# EAGLE design pro_event_light_b_mkI_base_board (EAGLE 7.7.0)

## Sheet 1 of 3: Spannungsversorgung
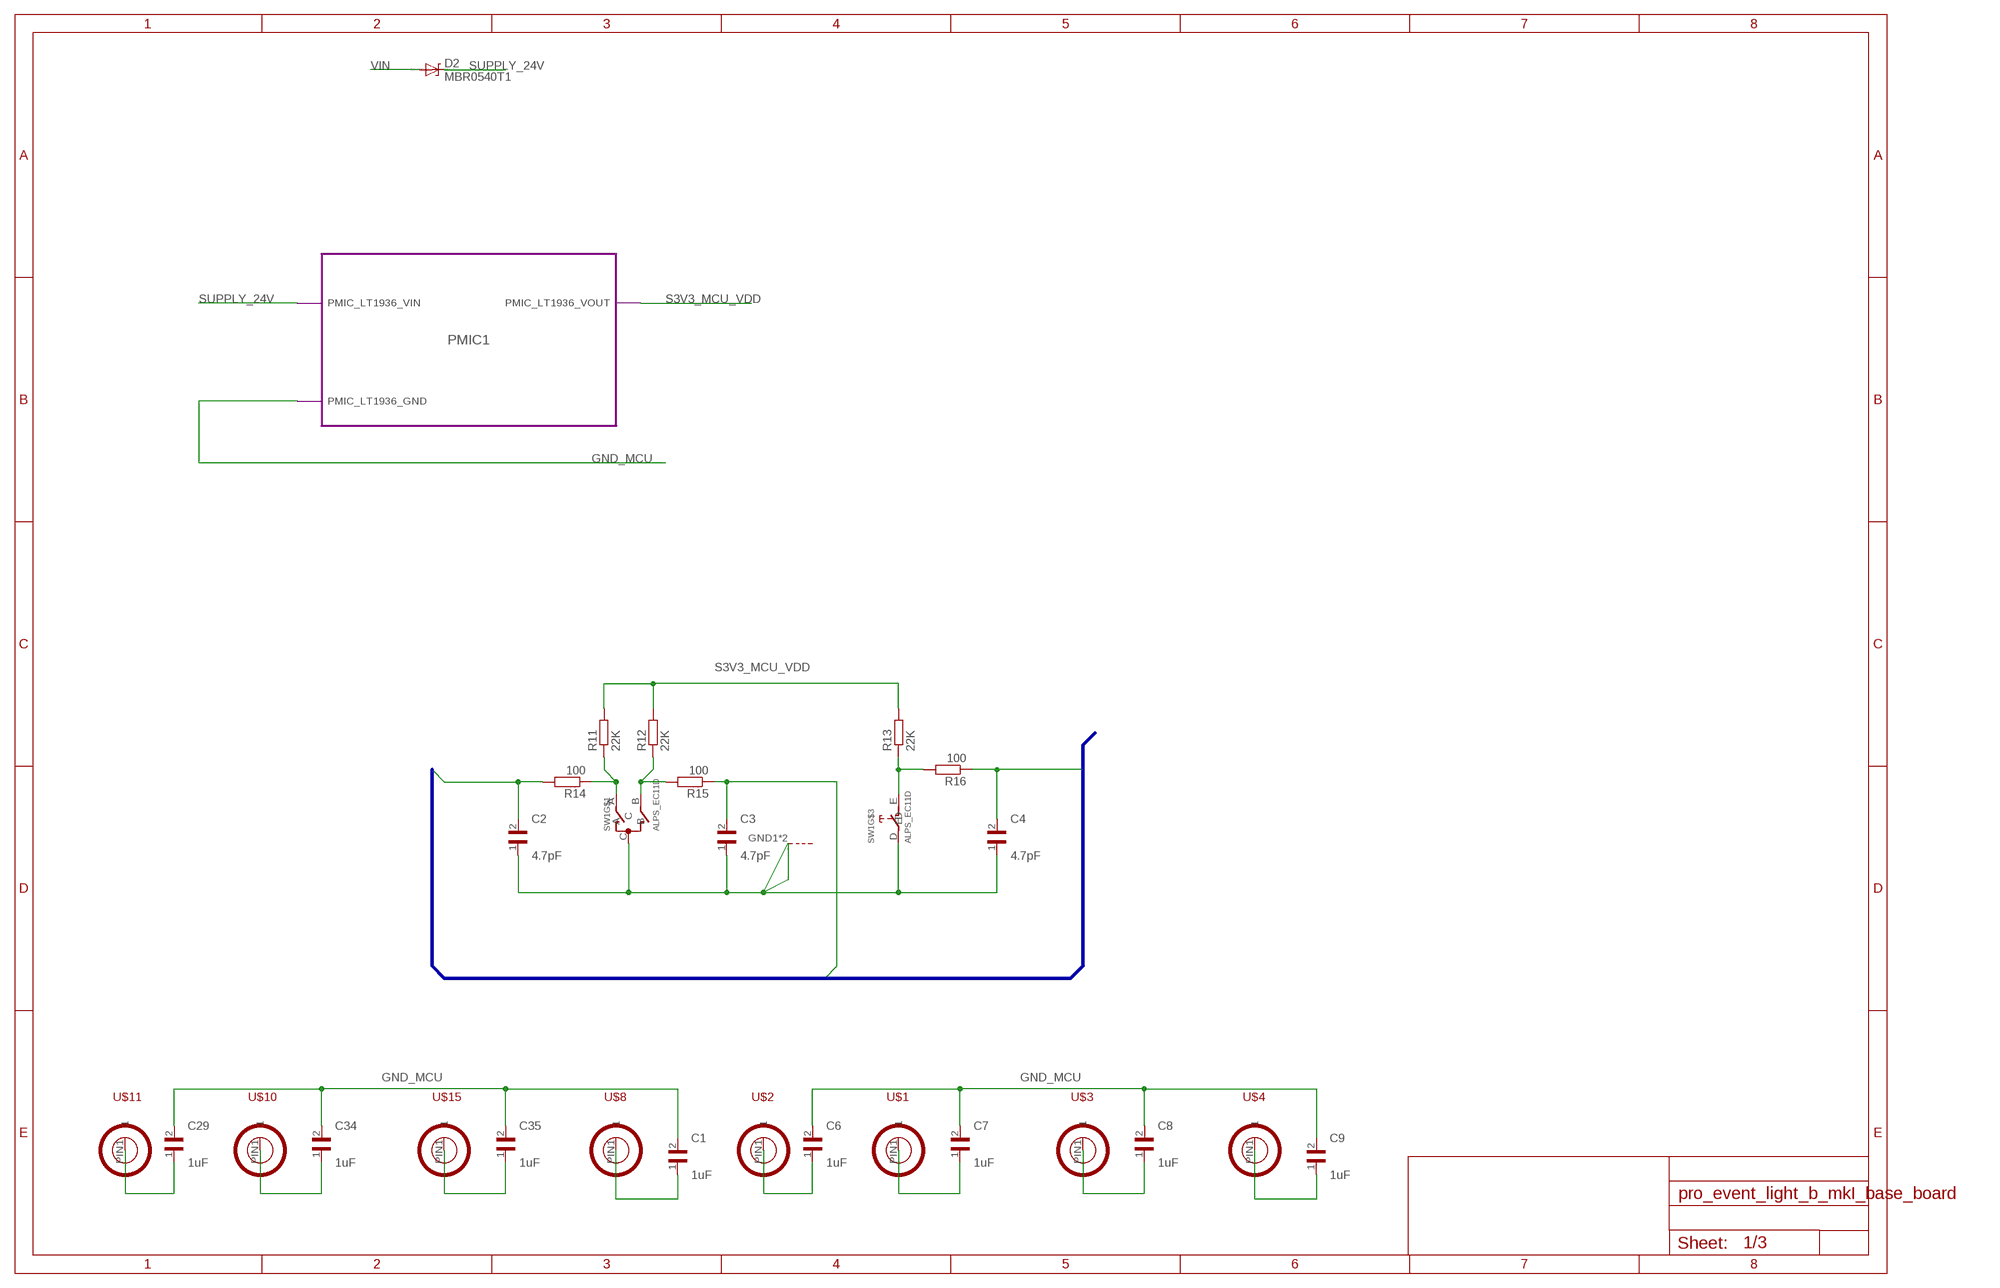
[diagram p0: schematic, sheet 1]

### Parts
C1  1uF  WCAP-CSGP_1206  [WCAP-CSGP_1206]
C2  4.7pF  WCAP-CSGP_0603-WAVE  [WCAP-CSGP_0603_WAVE]
C3  4.7pF  WCAP-CSGP_0603-WAVE  [WCAP-CSGP_0603_WAVE]
C4  4.7pF  WCAP-CSGP_0603-WAVE  [WCAP-CSGP_0603_WAVE]
C6  1uF  WCAP-CSGP_1206  [WCAP-CSGP_1206]
C7  1uF  WCAP-CSGP_1206  [WCAP-CSGP_1206]
C8  1uF  WCAP-CSGP_1206  [WCAP-CSGP_1206]
C9  1uF  WCAP-CSGP_1206  [WCAP-CSGP_1206]
C29  1uF  WCAP-CSGP_1206  [WCAP-CSGP_1206]
C34  1uF  WCAP-CSGP_1206  [WCAP-CSGP_1206]
C35  1uF  WCAP-CSGP_1206  [WCAP-CSGP_1206]
D2  MBR0540T1  [SOD123]
R11  22K  R-EU_R0603  [R0603]
R12  22K  R-EU_R0603  [R0603]
R13  22K  R-EU_R0603  [R0603]
R14  100  R-EU_R0603  [R0603]
R15  100  R-EU_R0603  [R0603]
R16  100  R-EU_R0603  [R0603]
SW1  ALPS_EC11D  [ALPS_EC11D]
U$1  PCB_MOUNTING_HOLES_M3  [PCB_MOUNTING_HOLES_M3]
U$2  PCB_MOUNTING_HOLES_M3  [PCB_MOUNTING_HOLES_M3]
U$3  PCB_MOUNTING_HOLES_M3  [PCB_MOUNTING_HOLES_M3]
U$4  PCB_MOUNTING_HOLES_M3  [PCB_MOUNTING_HOLES_M3]
U$8  PCB_MOUNTING_HOLES_M3  [PCB_MOUNTING_HOLES_M3]
U$10  PCB_MOUNTING_HOLES_M3  [PCB_MOUNTING_HOLES_M3]
U$11  PCB_MOUNTING_HOLES_M3  [PCB_MOUNTING_HOLES_M3]
U$15  PCB_MOUNTING_HOLES_M3  [PCB_MOUNTING_HOLES_M3]

### Module instances
PMIC1 = PMIC_LT1936

### Nets
ENCODER_A: C2.2 R14.2 ; also sheet 2
ENCODER_B: C3.2 R15.1 ; also sheet 2
ENCODER_D: C4.2 R16.1 ; also sheet 2
GND_MCU [MCU_Ground]: C1.2 C2.1 C3.1 C4.1 C6.2 C7.2 C8.2 C9.2 C29.2 C34.2 C35.2 SW1.C SW1.D SW1.GND1(G) SW1.GND2(G) ; port PMIC1.PMIC_LT1936_GND ; also sheet 2,3
N$1: R11.1 R14.1 SW1.A
N$2: R12.1 R15.2 SW1.B
N$5: C6.1 U$2.PIN1
N$8: C7.1 U$1.PIN1
N$9: C29.1 U$11.PIN1
N$10: C8.1 U$3.PIN1
N$11: C9.1 U$4.PIN1
N$15: C34.1 U$10.PIN1
N$16: R13.1 R16.2 SW1.E
N$17: C35.1 U$15.PIN1
N$18: C1.1 U$8.PIN1
S3V3_MCU_VDD: R11.2 R12.2 R13.2 ; port PMIC1.PMIC_LT1936_VOUT ; also sheet 2
SUPPLY_24V [MCU_Power]: D2.C ; port PMIC1.PMIC_LT1936_VIN ; also sheet 3
VIN: D2.A

### Buses
ENCODER_BUS:ENCODER_A,ENCODER_B,ENCODER_D

## Sheet 2 of 3: Mikrocontroller
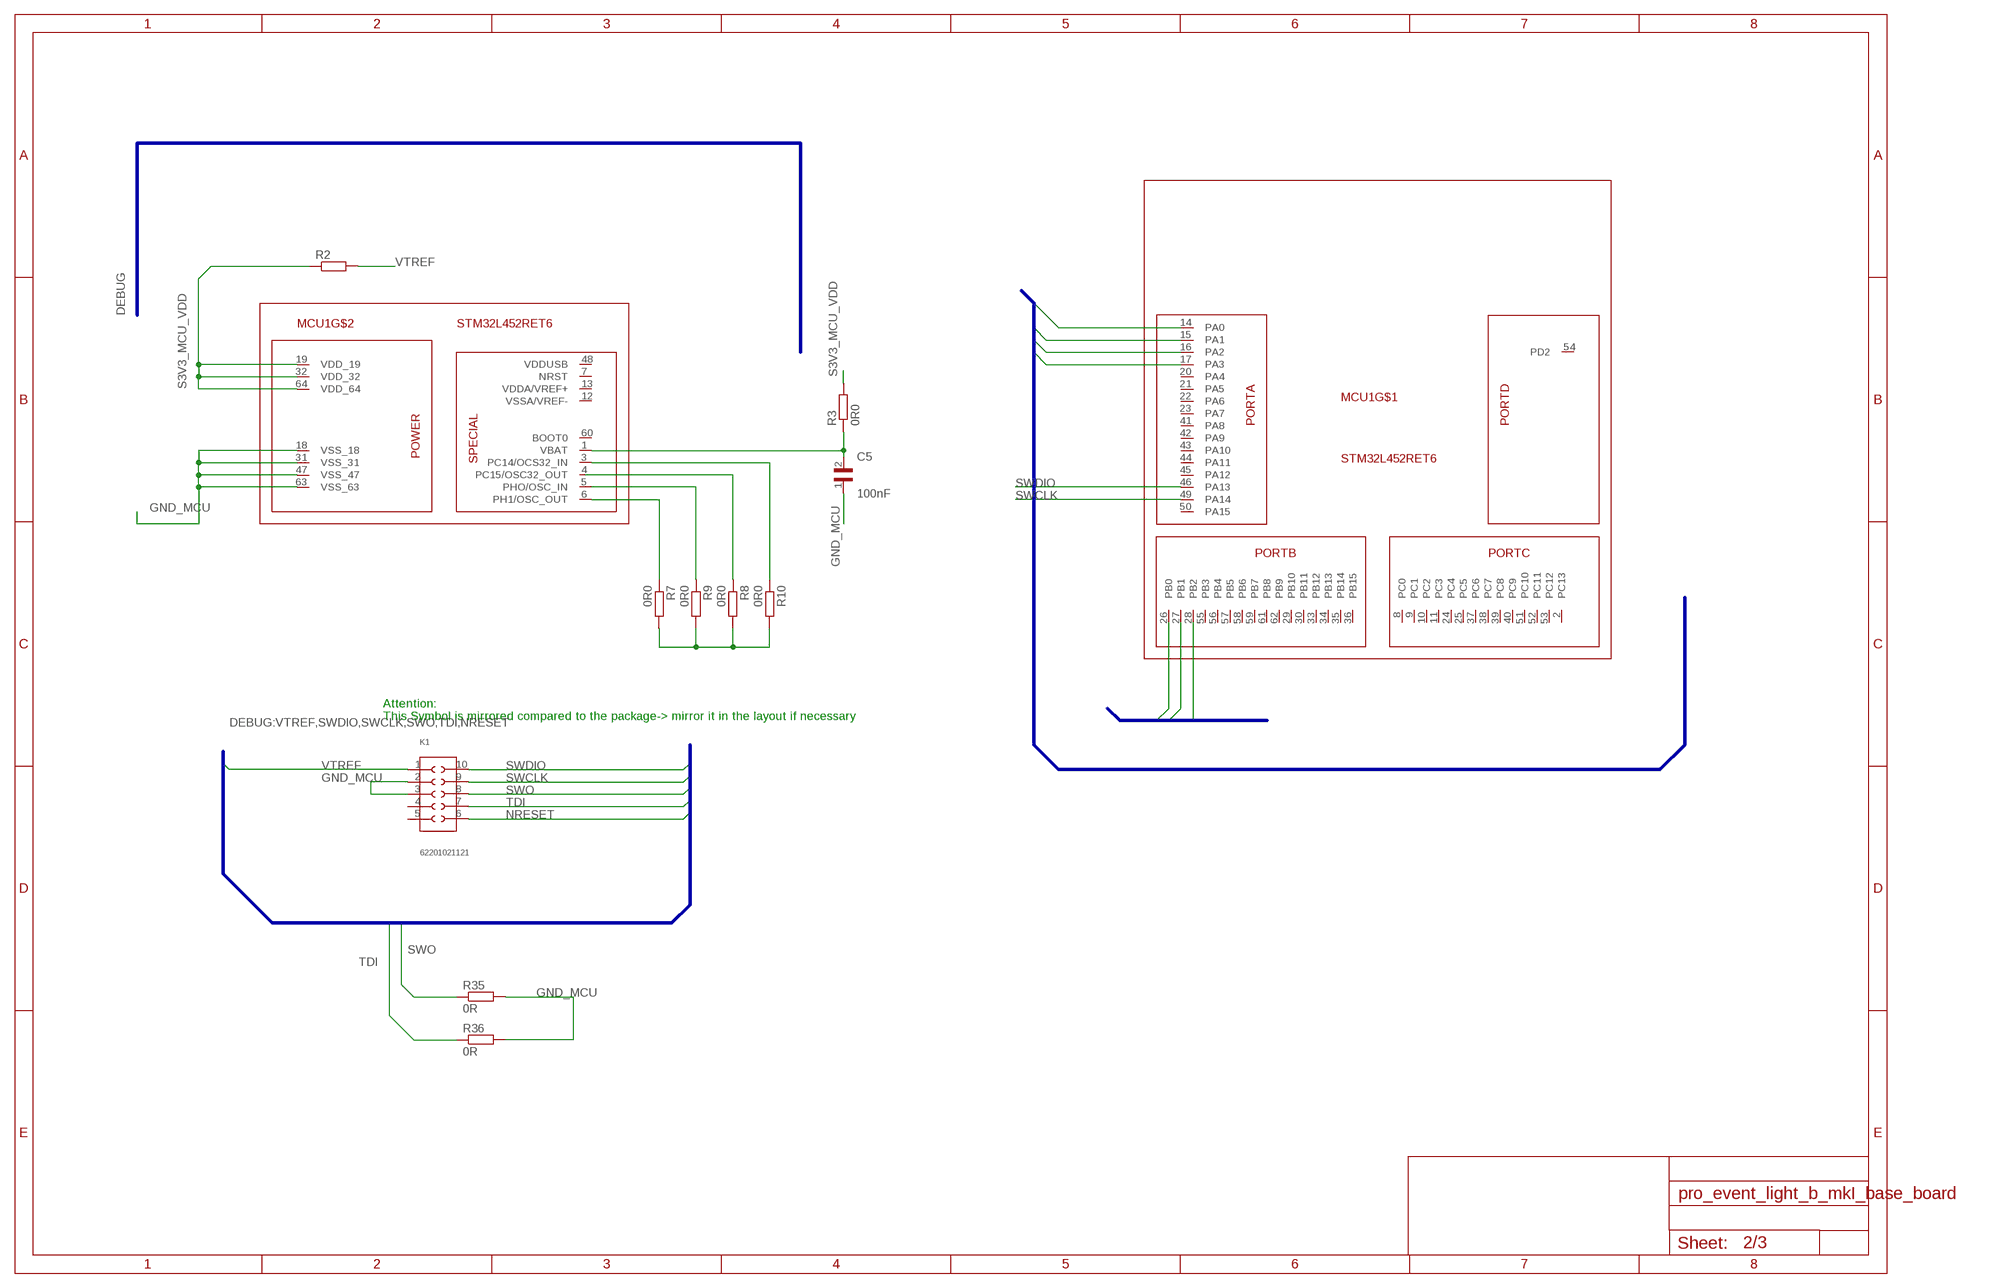
[diagram p1: schematic, sheet 2]

### Parts
C5  100nF  WCAP-CSGP_0603-REFLOW  [WCAP-CSGP_0603_REFLOW]
K1  62201021121  [62201021121]
MCU1  STM32L452RET6  [LQFP64]
R2  R-EU_R0603  [R0603]
R3  0R0  R-EU_R0603  [R0603]
R7  0R0  R-EU_R0603  [R0603]
R8  0R0  R-EU_R0603  [R0603]
R9  0R0  R-EU_R0603  [R0603]
R10  0R0  R-EU_R0603  [R0603]
R35  0R  R-EU_R0603  [R0603]
R36  0R  R-EU_R0603  [R0603]

### Nets
ENCODER_A: MCU1.26(PB0) ; also sheet 1
ENCODER_B: MCU1.27(PB1) ; also sheet 1
ENCODER_D: MCU1.28(PB2) ; also sheet 1
GND_MCU [MCU_Ground]: C5.1 K1.2 K1.3 MCU1.18(VSS_18) MCU1.47(VSS_47) MCU1.63(VSS_63) R7.2 R8.2 R9.2 R10.2 R35.2 R36.2 ; also sheet 1,3
LEDB: MCU1.15(PA1) ; also sheet 3
LEDG: MCU1.14(PA0) ; also sheet 3
LEDR: MCU1.16(PA2) ; also sheet 3
LEDW: MCU1.17(PA3) ; also sheet 3
N$19: C5.2 MCU1.1(VBAT) R3.1
N$20: MCU1.3(PC14/OCS32_IN) R10.1
N$21: R8.1
N$26: MCU1.5(PHO/OSC_IN) R9.1
N$27: MCU1.6(PH1/OSC_OUT) R7.1
NRESET [Debug]: K1.6
S3V3_MCU_VDD: MCU1.19(VDD_19) MCU1.32(VDD_32) MCU1.64(VDD_64) R2.1 R3.2 ; also sheet 1
SWCLK [Debug]: K1.9 MCU1.49(PA14)
SWDIO [Debug]: K1.10 MCU1.46(PA13)
SWO [Debug]: K1.8 R35.1
TDI [Debug]: K1.7 R36.1
VTREF [Debug]: K1.1 R2.2
Unconnected: K1.4 K1.5 MCU1.2(PC13) MCU1.4(PC15/OSC32_OUT) MCU1.7(NRST) MCU1.8(PC0) MCU1.9(PC1) MCU1.10(PC2) MCU1.11(PC3) MCU1.12(VSSA/VREF-) MCU1.13(VDDA/VREF+) MCU1.20(PA4) MCU1.21(PA5) MCU1.22(PA6) MCU1.23(PA7) MCU1.24(PC4) MCU1.25(PC5) MCU1.29(PB10) MCU1.30(PB11) MCU1.31(VSS_31) MCU1.33(PB12) MCU1.34(PB13) MCU1.35(PB14) MCU1.36(PB15) MCU1.37(PC6) MCU1.38(PC7) MCU1.39(PC8) MCU1.40(PC9) MCU1.41(PA8) MCU1.42(PA9) MCU1.43(PA10) MCU1.44(PA11) MCU1.45(PA12) MCU1.48(VDDUSB) MCU1.50(PA15) MCU1.51(PC10) MCU1.52(PC11) MCU1.53(PC12) MCU1.54(PD2) MCU1.55(PB3) MCU1.56(PB4) MCU1.57(PB5) MCU1.58(PB6) MCU1.59(PB7) MCU1.60(BOOT0) MCU1.61(PB8) MCU1.62(PB9)

### Buses
DEBUG:VTREF,SWDIO,SWCLK,SWO,TDI,NRESET
DEBUG
LEDBUS:LEDG,LEDB,LEDR,LEDW
ENCODER_BUS:ENCODER_A,ENCODER_B,ENCODER_D

### Notes on the sheet
- Attention:
  This Symbol is mirrored compared to the package-> mirror it in the layout if necessary

## Sheet 3 of 3: LED Power
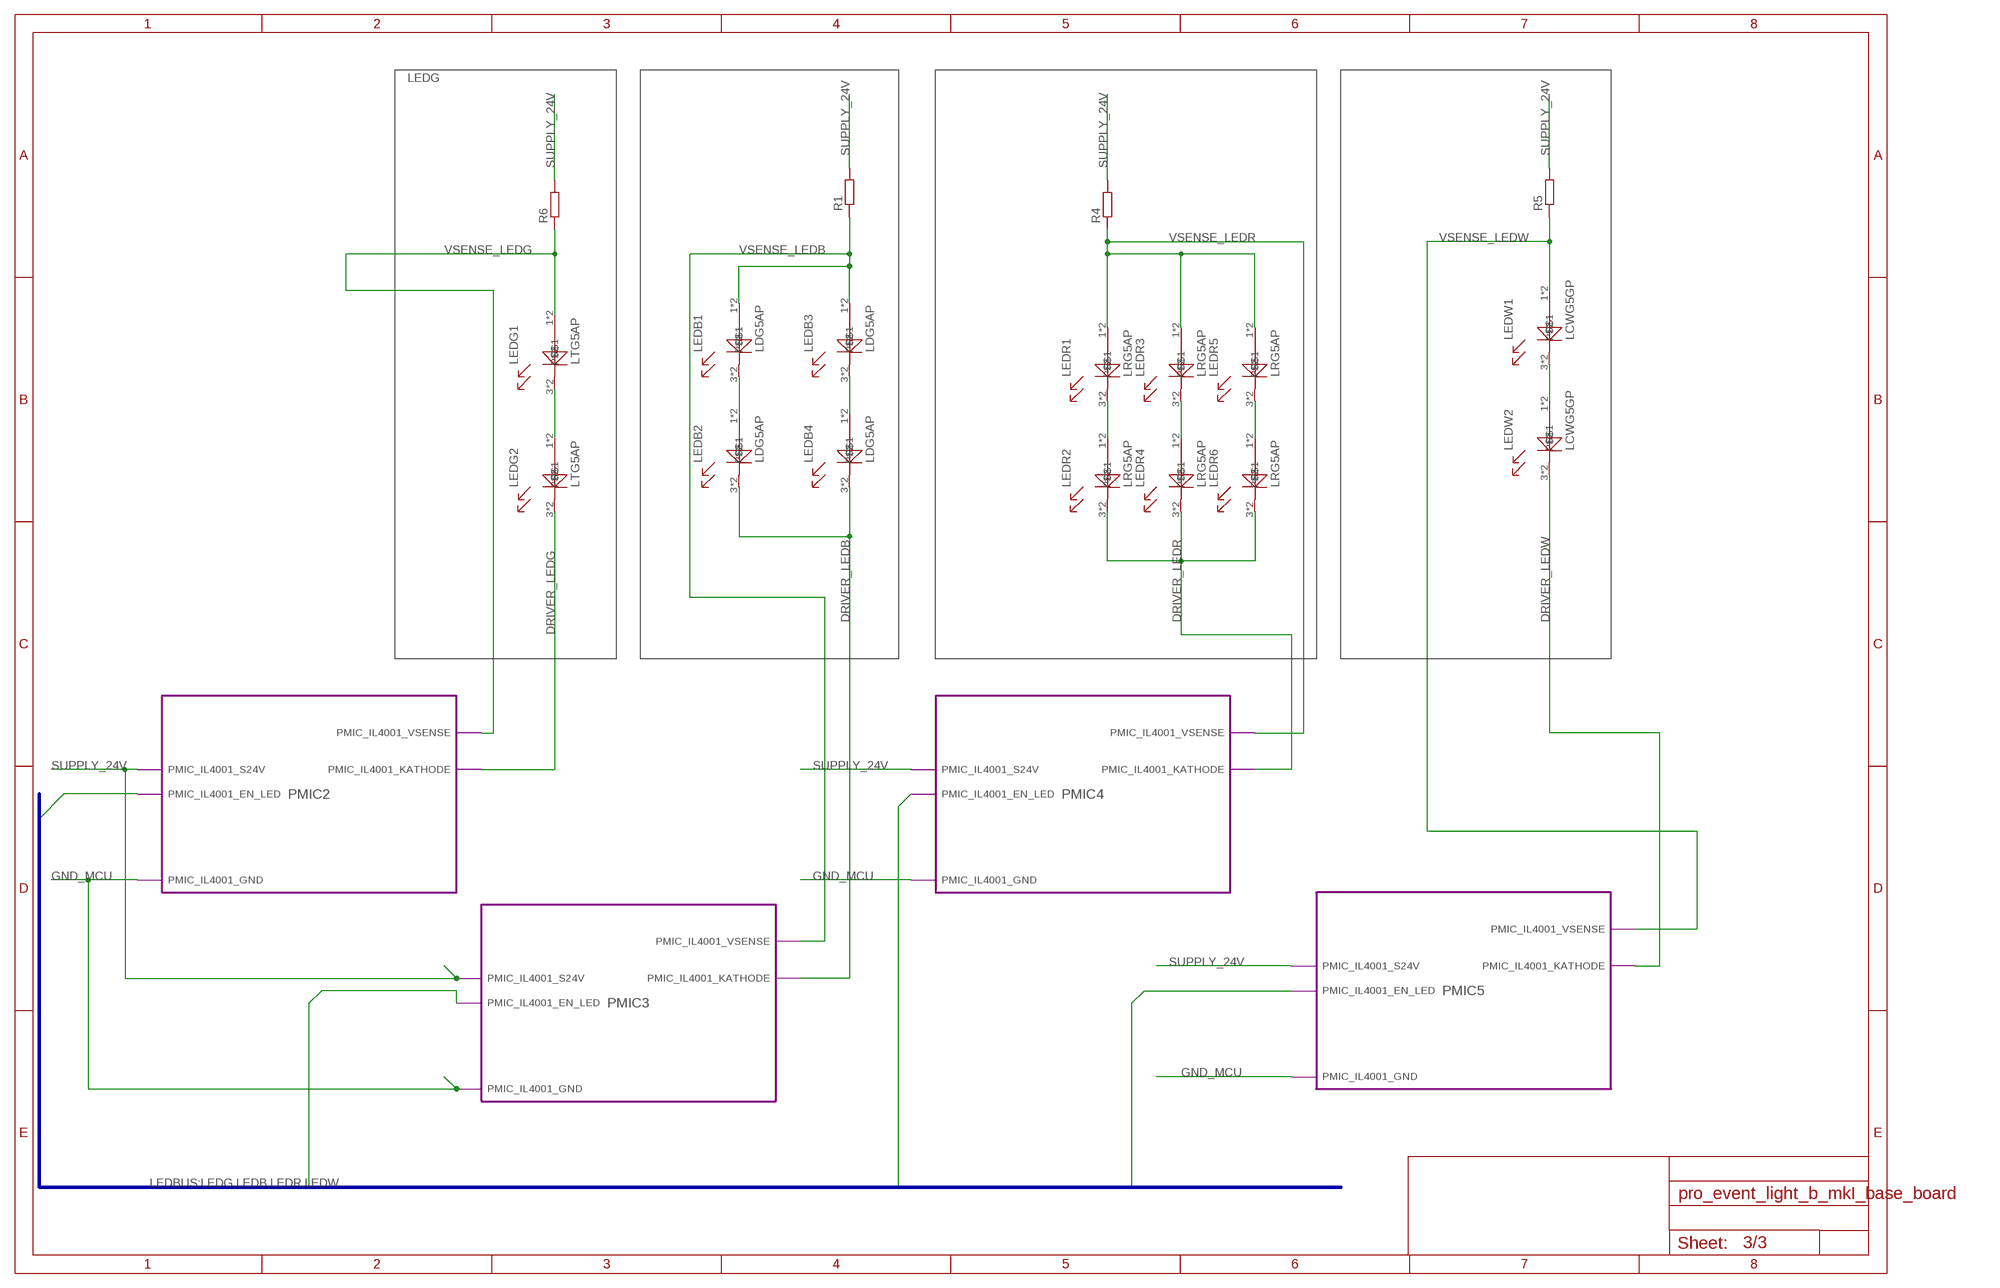
[diagram p2: schematic, sheet 3]

### Parts
LEDB1  LDG5AP  [P-LCC-2]
LEDB2  LDG5AP  [P-LCC-2]
LEDB3  LDG5AP  [P-LCC-2]
LEDB4  LDG5AP  [P-LCC-2]
LEDG1  LTG5AP  [P-LCC-2]
LEDG2  LTG5AP  [P-LCC-2]
LEDR1  LRG5AP  [P-LCC-2]
LEDR2  LRG5AP  [P-LCC-2]
LEDR3  LRG5AP  [P-LCC-2]
LEDR4  LRG5AP  [P-LCC-2]
LEDR5  LRG5AP  [P-LCC-2]
LEDR6  LRG5AP  [P-LCC-2]
LEDW1  LCWG5GP  [P-LCC-2]
LEDW2  LCWG5GP  [P-LCC-2]
R1  R-EU_R0603  [R0603]
R4  R-EU_R0603  [R0603]
R5  R-EU_R0603  [R0603]
R6  R-EU_R0603  [R0603]

### Module instances
PMIC2 = PMIC_IL4001
PMIC4 = PMIC_IL4001
PMIC5 = PMIC_IL4001
PMIC3 = PMIC_IL4001

### Nets
DRIVER_LEDB: LEDB2.3 LEDB2.4 LEDB4.3 LEDB4.4 ; port PMIC3.PMIC_IL4001_KATHODE
DRIVER_LEDG: LEDG2.3 LEDG2.4 ; port PMIC2.PMIC_IL4001_KATHODE
DRIVER_LEDR: LEDR2.3 LEDR2.4 LEDR4.3 LEDR4.4 LEDR6.3 LEDR6.4 ; port PMIC4.PMIC_IL4001_KATHODE
DRIVER_LEDW: LEDW2.3 LEDW2.4 ; port PMIC5.PMIC_IL4001_KATHODE
GND_MCU [MCU_Ground]: port PMIC2.PMIC_IL4001_GND PMIC3.PMIC_IL4001_GND PMIC5.PMIC_IL4001_GND PMIC4.PMIC_IL4001_GND ; also sheet 1,2
LEDB: port PMIC3.PMIC_IL4001_EN_LED ; also sheet 2
LEDG: port PMIC2.PMIC_IL4001_EN_LED ; also sheet 2
LEDR: port PMIC4.PMIC_IL4001_EN_LED ; also sheet 2
LEDW: port PMIC5.PMIC_IL4001_EN_LED ; also sheet 2
N$3: LEDG1.3 LEDG1.4 LEDG2.1 LEDG2.2
N$4: LEDB1.3 LEDB1.4 LEDB2.1 LEDB2.2
N$6: LEDB3.3 LEDB3.4 LEDB4.1 LEDB4.2
N$7: LEDR1.3 LEDR1.4 LEDR2.1 LEDR2.2
N$12: LEDR3.3 LEDR3.4 LEDR4.1 LEDR4.2
N$14: LEDR5.3 LEDR5.4 LEDR6.1 LEDR6.2
N$25: LEDW1.3 LEDW1.4 LEDW2.1 LEDW2.2
SUPPLY_24V [MCU_Power]: R1.2 R4.2 R5.2 R6.2 ; port PMIC2.PMIC_IL4001_S24V PMIC3.PMIC_IL4001_S24V PMIC5.PMIC_IL4001_S24V PMIC4.PMIC_IL4001_S24V ; also sheet 1
VSENSE_LEDB: LEDB1.1 LEDB1.2 LEDB3.1 LEDB3.2 R1.1 ; port PMIC3.PMIC_IL4001_VSENSE
VSENSE_LEDG: LEDG1.1 LEDG1.2 R6.1 ; port PMIC2.PMIC_IL4001_VSENSE
VSENSE_LEDR: LEDR1.1 LEDR1.2 LEDR3.1 LEDR3.2 LEDR5.1 LEDR5.2 R4.1 ; port PMIC4.PMIC_IL4001_VSENSE
VSENSE_LEDW: LEDW1.1 LEDW1.2 R5.1 ; port PMIC5.PMIC_IL4001_VSENSE

### Buses
LEDBUS:LEDG,LEDB,LEDR,LEDW

### Notes on the sheet
- LEDG

## Library data of the parts
C1-C9 C29 C34 C35 = Eagle_Wurth_Elektronik_Passive_Capacitors_rev15a:WCAP-CSGP: WCAP-CSGP Ceramic Capacitors Characteristics Multilayer Ceramic Chip Capacitor Recommended soldering:Reflow, for 0603 and 0805 wave soldering is also allowed Operating temperature:-55 °C to +125 °C; Ceramic characteristics: Class I - NPO ; Class II -X7R, X5R High performance ceramic High capacitance stability Minimal aging Termination:Cu/Ni/Sn <http://katalog.we-online.de/media/images/eisos/WCAP-CSGP_pf2.jpg> Details see: http://katalog.we-online.de/en/pbs/WCAP-CSGP/?m Created: 2015-01-28 2015 (C) Wurth Elektronik
D2 = mod_eagle_library_discrete_elements:MBR0540T1: MBR0540T1
K1 = Board_to_Board_Connectors_rev15d:62201021121: WR-PHD 1.27mm Dual Pin Header, 10 Pins=>Code : Con_BTB_PHD_1.27_2_62201021121 <http://katalog.we-online.de/media/thumbs2/eican/thb_Con_BTB_PHD_1.27_2_6220xx21121_pf2.jpg> Details see: http://katalog.we-online.de/en/em/622_0xx_211_21 Created 2014-06-03, Karrer Zheng 2014 (C) Würth Elektronik
LEDB1-LEDB4 = mod_eagle_library_discrete_elements:LDG5AP: OSRAM Advanced Power TOPLED LDG5AP deep blue
LEDG1 LEDG2 = mod_eagle_library_discrete_elements:LTG5AP: OSRAM Advanced Power TOPLED LTG5AP true green
LEDR1-LEDR6 = mod_eagle_library_discrete_elements:LRG5AP: OSRAM Advanced Power TOPLED LRG5AP single color red
LEDW1 LEDW2 = mod_eagle_library_discrete_elements:LCWG5GP: OSRAM Advanced Power TOPLED LCWG5GP warm white
MCU1 = mod_eagle_library_MCU_CPU:STM32L452RET6: STM32L452RET6
R1-R16 R35 R36 = rcl:R-EU_: RESISTOR, European symbol
SW1 = mod_eagle_library_switches:ALPS_EC11D: ALPS EC11D rotary switch
U$1-U$4 U$8 U$10 U$11 U$15 = mod-eagle_library_standard_passive_parts:PCB_MOUNTING_HOLES_M3

## Module PMIC_IL4001
Ports: PMIC_IL4001_S24V(io) PMIC_IL4001_EN_LED(io) PMIC_IL4001_GND(io) PMIC_IL4001_KATHODE(io) PMIC_IL4001_VSENSE(io)
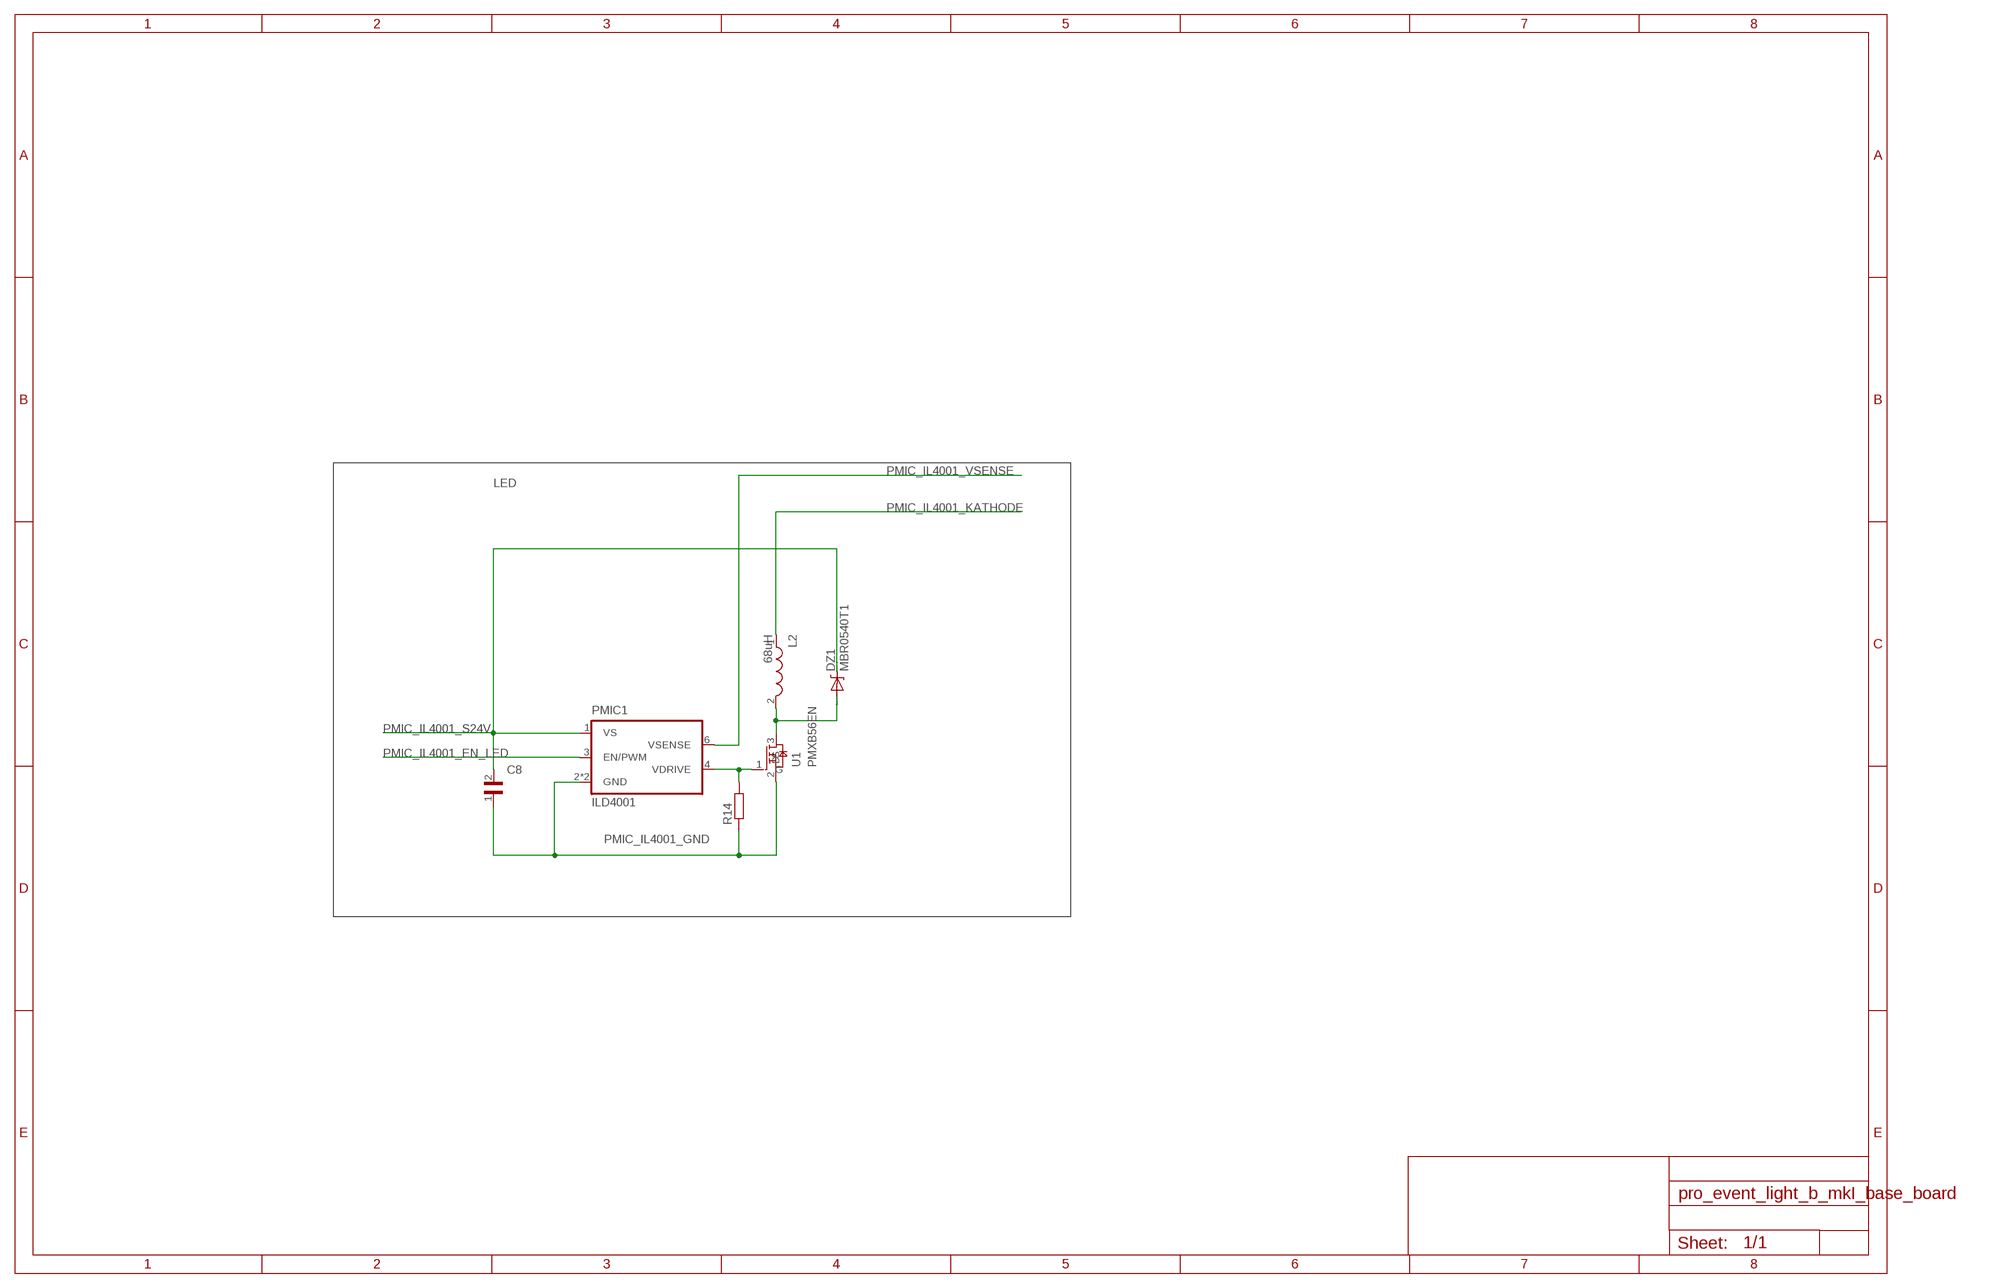
[diagram p3: schematic, module PMIC_IL4001, sheet 1]

### Parts
C8  WCAP-CSGP_0603-WAVE  [WCAP-CSGP_0603_WAVE]
DZ1  MBR0540T1  [SOD123]
L2  68uH  WE-LQ_1210  [WE-LQ_M]
PMIC1  ILD4001  [SC74_INFINEON]
R14  R-EU_R0603  [R0603]
U1  PMXB56EN  [DFN1010D-3]

### Nets
N$2: PMIC1.4(VDRIVE) R14.2 U1.1(G)
N$29: DZ1.A L2.2 U1.3(D)
PMIC_IL4001_EN_LED: PMIC1.3(EN/PWM)
PMIC_IL4001_GND [MCU_Ground]: C8.1 PMIC1.2(GND) PMIC1.5(GND) R14.1 U1.2(S)
PMIC_IL4001_KATHODE: L2.1
PMIC_IL4001_S24V: C8.2 DZ1.C PMIC1.1(VS)
PMIC_IL4001_VSENSE: PMIC1.6(VSENSE)

### Notes on the sheet
- LED

### Library data of the parts
C8 = Eagle_Wurth_Elektronik_Passive_Capacitors_rev15a:WCAP-CSGP: WCAP-CSGP Ceramic Capacitors Characteristics Multilayer Ceramic Chip Capacitor Recommended soldering:Reflow, for 0603 and 0805 wave soldering is also allowed Operating temperature:-55 °C to +125 °C; Ceramic characteristics: Class I - NPO ; Class II -X7R, X5R High performance ceramic High capacitance stability Minimal aging Termination:Cu/Ni/Sn <http://katalog.we-online.de/media/images/eisos/WCAP-CSGP_pf2.jpg> Details see: http://katalog.we-online.de/en/pbs/WCAP-CSGP/?m Created: 2015-01-28 2015 (C) Wurth Elektronik
DZ1 = mod_eagle_library_discrete_elements:MBR0540T1: MBR0540T1
L2 = EagleLibrary_Wuerth_Elektronik_eiSos_rev16a:WE-LQ: SMD Inductor Characteristics Miniature chip inductor wound on a special ferrite core Small inductances for compact circuits High Q at high frequencies Low DC-resistance Operating temperature: –40 ºC to +125 ºC Applications Low power DC/DC-converters from Linear Technology, National Semiconductor, Texas Instruments, Fairchild Semiconductor, ON Semiconductor, STMicroelectronics, Maxim, MPS, Semtech, Exar, Analogic Tech, Diodes and Cologne Chip EMI-Filtering RF-circuits <http://katalog.we-online.de/media/images/eisos/IndLQ_pf2.jpg> Details see: http://katalog.we-online.de/en/pbs/WE-LQ? Updated by Dan Xu 2014-07-08 2014 (C) Wurth Elektronik
PMIC1 = infineon:ILD4001: LED Driver for High Power LEDs Source: http://www.infineon.com/dgdl/ILD4001-Step-down-LED-Controller-Rev2.0.pdf?folderId=db3a30431f848401011fcbf2ab4c04c4&fileId=db3a30433072cd8f01308fc1af03786b
R14 = rcl:R-EU_: RESISTOR, European symbol
U1 = mod_eagle_library_discrete_elements:PMXB56EN

## Module PMIC_LT1936
Ports: PMIC_LT1936_VIN(io) PMIC_LT1936_VOUT(io) PMIC_LT1936_GND(io)
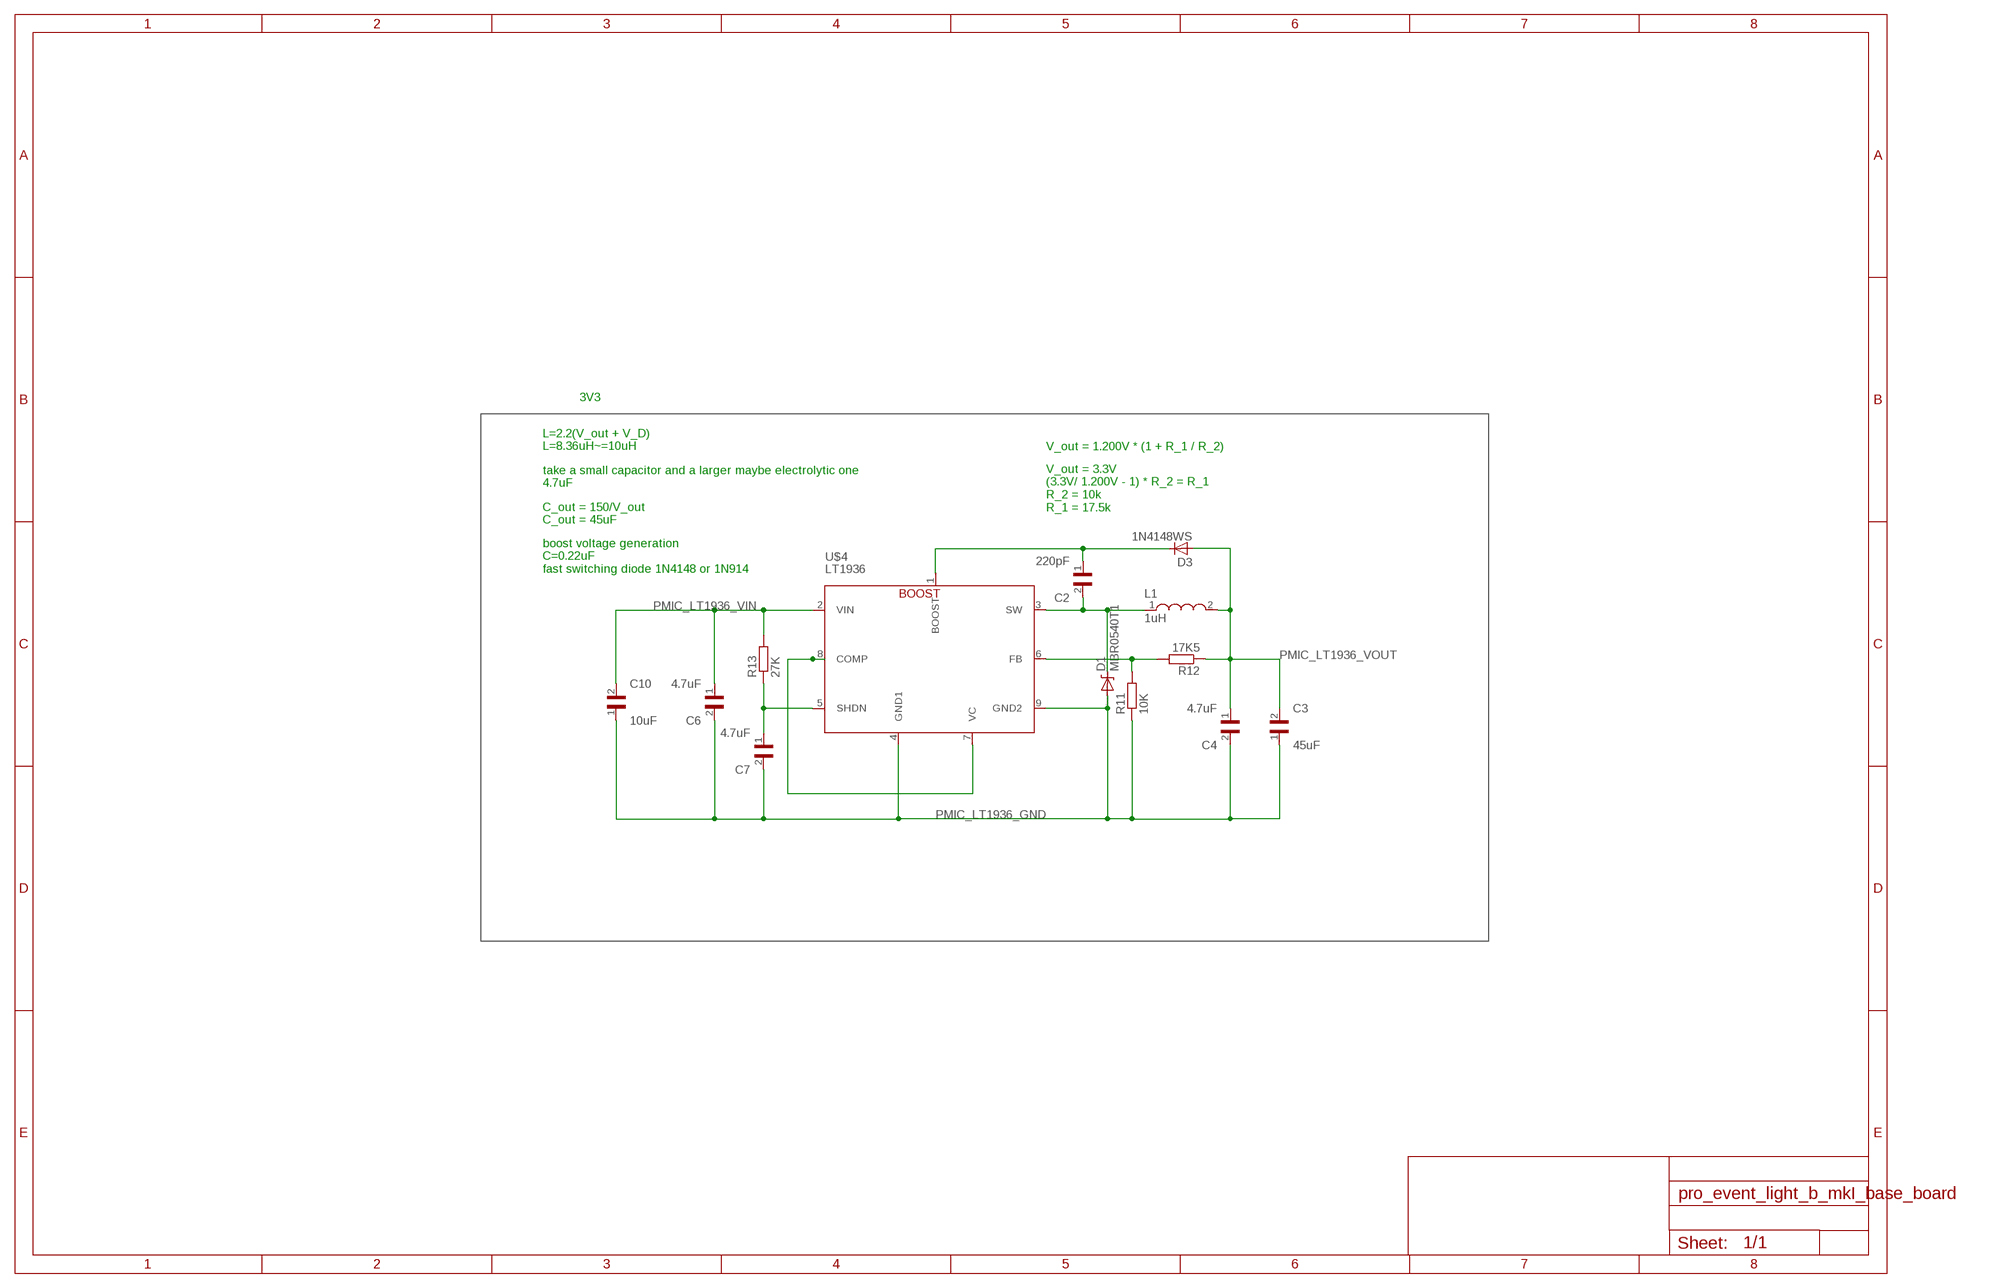
[diagram p4: schematic, module PMIC_LT1936, sheet 1]

### Parts
C2  220pF  WCAP-CSGP_0603-WAVE  [WCAP-CSGP_0603_WAVE]
C3  45uF  WCAP-ASNP_4X5.5(DXL)  [2.6X1.6X1(BXCXA)]
C4  4.7uF  WCAP-CSGP_0603-WAVE  [WCAP-CSGP_0603_WAVE]
C6  4.7uF  WCAP-CSGP_0603-WAVE  [WCAP-CSGP_0603_WAVE]
C7  4.7uF  WCAP-CSGP_0603-WAVE  [WCAP-CSGP_0603_WAVE]
C10  10uF  WCAP-ASNP_4X5.5(DXL)  [2.6X1.6X1(BXCXA)]
D1  MBR0540T1  [SOD123]
D3  1N4148WS  [SOD323]
L1  1uH  WE-LQ_1210  [WE-LQ_M]
R11  10K  R-EU_R0603  [R0603]
R12  17K5  R-EU_R0603  [R0603]
R13  27K  R-EU_R0603  [R0603]
U$4  LT1936  [MSOP8]

### Nets
N$28: U$4.7(VC) U$4.8(COMP)
N$30: C7.1 R13.1 U$4.5(SHDN)
N$35: R11.2 R12.2 U$4.6(FB)
PMIC_LT1936_BOOST: C2.1 D3.C U$4.1(BOOST)
PMIC_LT1936_GND [MCU_Ground]: C3.1 C4.2 C6.2 C7.2 C10.1 D1.A R11.1 U$4.4(GND1) U$4.9(GND2)
PMIC_LT1936_SW: C2.2 D1.C L1.1 U$4.3(SW)
PMIC_LT1936_VIN: C6.1 C10.2 R13.2 U$4.2(VIN)
PMIC_LT1936_VOUT: C3.2 C4.1 D3.A L1.2 R12.1

### Notes on the sheet
- 3V3
- L=2.2(V_out + V_D)
  L=8.36uH~=10uH
- V_out = 1.200V * (1 + R_1 / R_2)
- take a small capacitor and a larger maybe electrolytic one
  4.7uF
- V_out = 3.3V
  (3.3V/ 1.200V - 1) * R_2 = R_1
  R_2 = 10k
  R_1 = 17.5k
- C_out = 150/V_out
  C_out = 45uF
- boost voltage generation
  C=0.22uF
  fast switching diode 1N4148 or 1N914

### Library data of the parts
C2 C4 C6 C7 = Eagle_Wurth_Elektronik_Passive_Capacitors_rev15a:WCAP-CSGP: WCAP-CSGP Ceramic Capacitors Characteristics Multilayer Ceramic Chip Capacitor Recommended soldering:Reflow, for 0603 and 0805 wave soldering is also allowed Operating temperature:-55 °C to +125 °C; Ceramic characteristics: Class I - NPO ; Class II -X7R, X5R High performance ceramic High capacitance stability Minimal aging Termination:Cu/Ni/Sn <http://katalog.we-online.de/media/images/eisos/WCAP-CSGP_pf2.jpg> Details see: http://katalog.we-online.de/en/pbs/WCAP-CSGP/?m Created: 2015-01-28 2015 (C) Wurth Elektronik
C3 C10 = Eagle_Wurth_Elektronik_Passive_Capacitors_rev15a:WCAP-ASNP: WCAP-ASNP Aluminum Electrolytic Capacitors Characteristics Aluminum Electrolytic Capacitor Recommended soldering: Reflow Operating temperature: -40 °C to +85 °C Non-polarized product series with +85 °C max temperature Load life:2000 h @ +85 °C Package name and Variant abbreviation: Package: Package: B X C X A = length of the solder pad X width of the solder pad X pitch of the solder pad. Variant: D X L = Diameter of the body part X Height of the body part. <http://katalog.we-online.de/media/images/eisos/WCAP-ASNP_pf2.jpg> Details see: http://katalog.we-online.de/en/pbs/WCAP-ASNP?m Created: 2015-03-10 2015 (C) Wurth Elektronik
D1 = mod_eagle_library_discrete_elements:MBR0540T1: MBR0540T1
D3 = mod_eagle_library_discrete_elements:1N4148WS: 1N4148WS <https://www.vishay.com/diodes/list/product-85413>
L1 = EagleLibrary_Wuerth_Elektronik_eiSos_rev16a:WE-LQ: SMD Inductor Characteristics Miniature chip inductor wound on a special ferrite core Small inductances for compact circuits High Q at high frequencies Low DC-resistance Operating temperature: –40 ºC to +125 ºC Applications Low power DC/DC-converters from Linear Technology, National Semiconductor, Texas Instruments, Fairchild Semiconductor, ON Semiconductor, STMicroelectronics, Maxim, MPS, Semtech, Exar, Analogic Tech, Diodes and Cologne Chip EMI-Filtering RF-circuits <http://katalog.we-online.de/media/images/eisos/IndLQ_pf2.jpg> Details see: http://katalog.we-online.de/en/pbs/WE-LQ? Updated by Dan Xu 2014-07-08 2014 (C) Wurth Elektronik
R11-R13 = rcl:R-EU_: RESISTOR, European symbol
U$4 = mod_eagle_library_pmic:LT1936

## Net classes
4 MCU_Power: width 0.203 mm, clearance 0.152 mm to class 0, clearance 0.152 mm to class 1, clearance 0.152 mm to class 2, clearance 0.152 mm to class 3, clearance 0.152 mm
5 Debug: width 0.152 mm, drill 0.305 mm, clearance 0.152 mm to class 0, clearance 0.152 mm to class 1, clearance 0.152 mm to class 2, clearance 0.152 mm to class 3, clearance 0.152 mm to class 4, clearance 0.152 mm
8 MCU_Ground: width 0.203 mm, drill 0.203 mm, clearance 0.152 mm to class 0, clearance 0.152 mm to class 1, clearance 0.152 mm to class 2, clearance 0.152 mm to class 3, clearance 0.152 mm to class 4, clearance 0.152 mm to class 5, clearance 0.152 mm to class 6, clearance 0.152 mm to class 7, clearance 0.152 mm

## Board
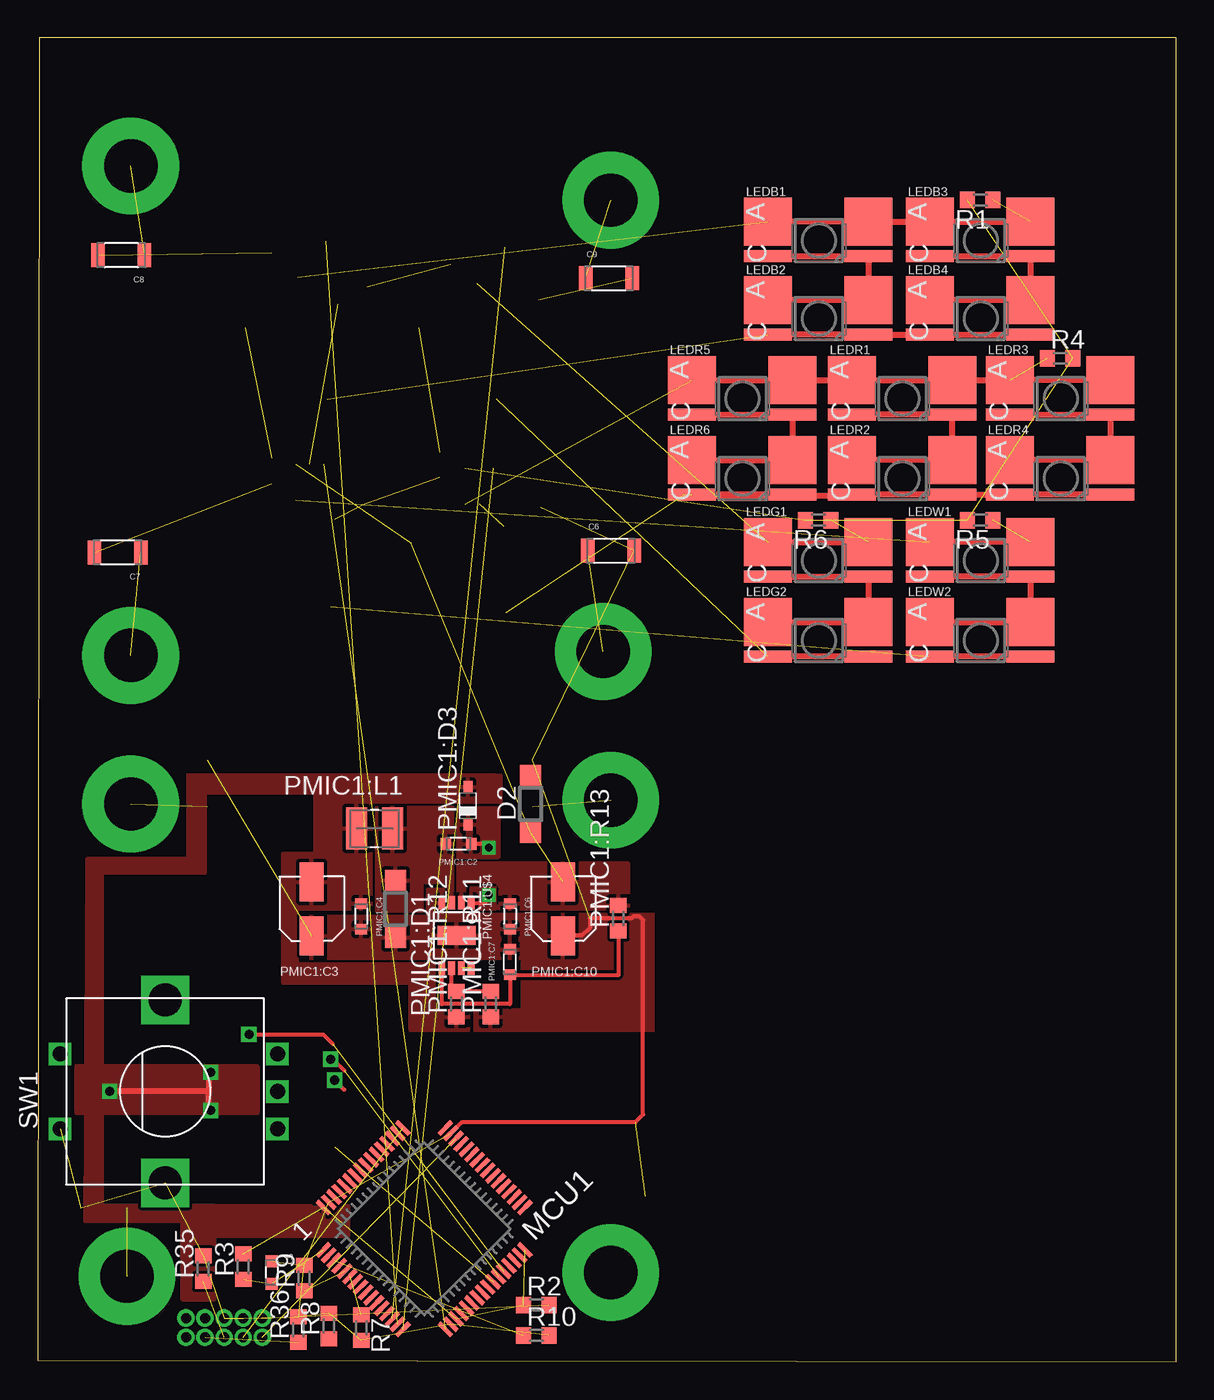
[diagram p5: board, top side]
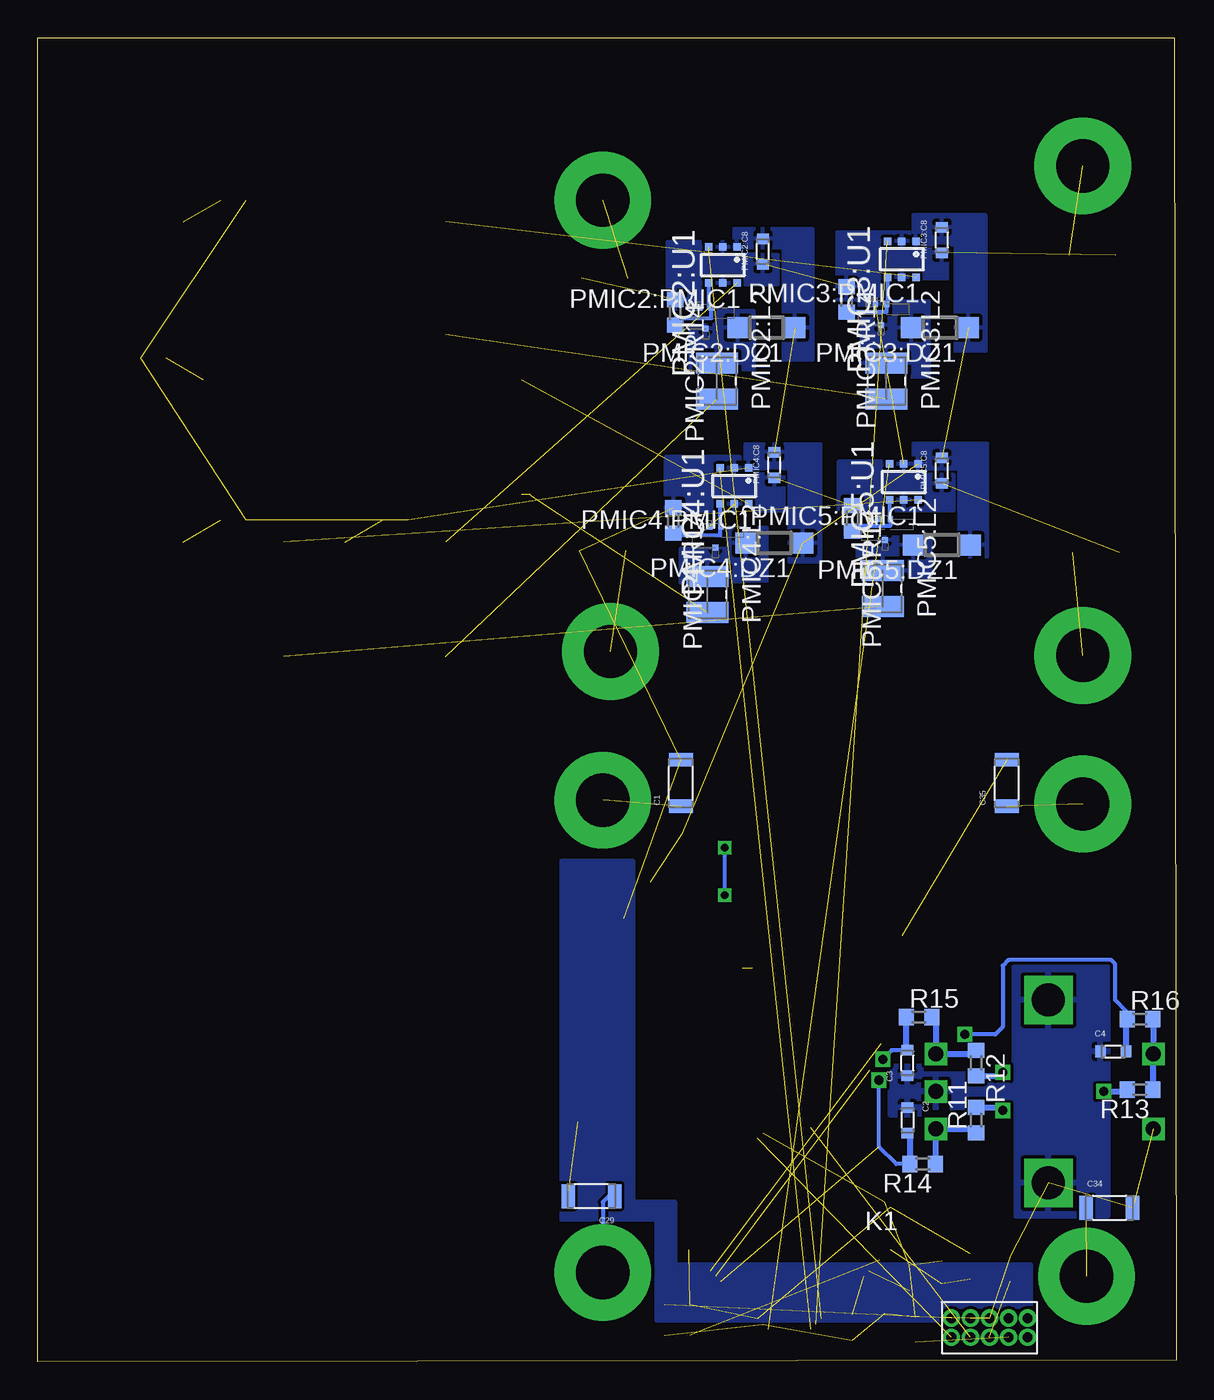
[diagram p6: board, bottom side, seen from below]

Size 75.93 x 88.32 mm. Coordinates in mm from the lower left corner, seen from the top.
Outline: 0,0.13 75.93,0 75.93,88.32 0.13,88.32 0,0.13
Copper layers (1*16): Top 0.035mm / dielectric 1.5mm / Bottom 0.035mm
Design rules "default": minimum track width 10mil, minimum drill 24mil, track to track 8mil, track to pad 8mil, pad to pad 8mil, via to via 8mil, smd to smd 8mil, copper to edge 40mil, drill to drill 8mil, minimum pad ring 10mil, minimum via ring 8mil, stop-mask expansion 4mil, vias tented up to drill 0mil, thermal gap 10mil

### Footprints (pad centres in the part's own frame; a part is rotated, then mirrored left to right if it is on the bottom)
WCAP-CSGP_1206 = smd 0.9 x 1.6: 1 -1.55,0; 2 1.55,0
WCAP-CSGP_0603_WAVE = smd 0.7 x 0.8: 1 -0.85,0; 2 0.85,0
WCAP-CSGP_0603_REFLOW = smd 0.8 x 0.8: 1 -0.75,0; 2 0.75,0
SOD123 = smd 1.4 x 1.4: A 1.9,0; C -1.9,0
62201021121 = drill 0.65: 1 -2.54,0.635; 2 -1.27,0.635; 3 0,0.635; 4 1.27,0.635; 5 2.54,0.635; 6 2.54,-0.635; 7 1.27,-0.635; 8 0,-0.635; 9 -1.27,-0.635; 10 -2.54,-0.635
P-LCC-2 = smd 3.2 x 3.2: 1 -3.35,1.6; 2 3.35,1.6 | smd 3.2 x 0.8: 3 -3.35,-0.7; 4 3.35,-0.7
LQFP64 = smd 1.2 x 0.3: 1 -5.75,3.75; 2 -5.75,3.25; 3 -5.75,2.75; 4 -5.75,2.25; 5 -5.75,1.75; 6 -5.75,1.25; 7 -5.75,0.75; 8 -5.75,0.25; 9 -5.75,-0.25; 10 -5.75,-0.75; 11 -5.75,-1.25; 12 -5.75,-1.75; 13 -5.75,-2.25; 14 -5.75,-2.75; 15 -5.75,-3.25; 16 -5.75,-3.75; 33 5.75,-3.75; 34 5.75,-3.25; 35 5.75,-2.75; 36 5.75,-2.25; 37 5.75,-1.75; 38 5.75,-1.25; 39 5.75,-0.75; 40 5.75,-0.25; 41 5.75,0.25; 42 5.75,0.75; 43 5.75,1.25; 44 5.75,1.75; 45 5.75,2.25; 46 5.75,2.75; 47 5.75,3.25; 48 5.75,3.75 | smd 0.3 x 1.2: 17 -3.75,-5.75; 18 -3.25,-5.75; 19 -2.75,-5.75; 20 -2.25,-5.75; 21 -1.75,-5.75; 22 -1.25,-5.75; 23 -0.75,-5.75; 24 -0.25,-5.75; 25 0.25,-5.75; 26 0.75,-5.75; 27 1.25,-5.75; 28 1.75,-5.75; 29 2.25,-5.75; 30 2.75,-5.75; 31 3.25,-5.75; 32 3.75,-5.75; 49 3.75,5.75; 50 3.25,5.75; 51 2.75,5.75; 52 2.25,5.75; 53 1.75,5.75; 54 1.25,5.75; 55 0.75,5.75; 56 0.25,5.75; 57 -0.25,5.75; 58 -0.75,5.75; 59 -1.25,5.75; 60 -1.75,5.75; 61 -2.25,5.75; 62 -2.75,5.75; 63 -3.25,5.75; 64 -3.75,5.75
2.6X1.6X1(BXCXA) = smd 2.6 x 1.6: 1 1.8,0; 2 -1.8,0
SOD323 = smd 0.8 x 0.6: A 1.25,0; C -1.25,0
WE-LQ_M = smd 1.4 x 2.8: 1 -1.2,0; 2 1.2,0
R0603 = smd 1 x 1.1: 1 -0.85,0; 2 0.85,0
MSOP8 = smd 0.45 x 0.9: 1 -0.975,-2.171; 2 -0.325,-2.171; 3 0.325,-2.171; 4 0.975,-2.171; 5 0.975,2.171; 6 0.325,2.171; 7 -0.325,2.171; 8 -0.975,2.171 | smd 2.54 x 1.27: 9 0,0
SC74_INFINEON = smd 0.5 x 0.5: 1 -0.95,-1.2; 2 0,-1.2; 3 0.95,-1.2; 4 0.95,1.2; 5 0,1.2; 6 -0.95,1.2
DFN1010D-3 = smd 0.35 x 0.4: 1 0.375,0.7; 2 -0.375,0.7 | smd 0.4 x 0.4: 3 0,-0.7
ALPS_EC11D = drill 1 square: A -2.5,-7.5; B 2.5,-7.5; C 0,-7.5; D -2.5,7; E 2.5,7 | drill 2.2 square: GND1 -6.1,0; GND2 6.1,0
PCB_MOUNTING_HOLES_M3 = drill 3.556 pad 6.452: PIN1 0,0

### Placement (x,y rotation side)
C1  33.02,38.61 90 bottom
C2  17.91,16.13 270 bottom
C3  17.91,19.94 90 bottom
C4  4.19,20.7 0 bottom
C5  15.62,5.97 270 top
C6  38.23,54.1 0 top
C7  5.33,53.98 180 top
C8  5.59,73.79 180 top
C9  38.1,72.26 0 top
C29  38.99,11.05 180 bottom
C34  4.45,10.29 0 bottom
C35  11.3,38.61 90 bottom
D2  32.89,37.21 90 top
K1  12.45,2.29 0 bottom
LEDB1  52.07,74.42 0 top
LEDB2  52.07,69.21 0 top
LEDB3  62.87,74.42 0 top
LEDB4  62.87,69.21 0 top
LEDG1  52.07,53.09 0 top
LEDG2  52.07,47.75 0 top
LEDR1  57.66,63.88 0 top
LEDR2  57.66,58.55 0 top
LEDR3  68.2,63.88 0 top
LEDR4  68.2,58.55 0 top
LEDR5  46.99,63.88 0 top
LEDR6  46.99,58.55 0 top
LEDW1  62.87,53.09 0 top
LEDW2  62.87,47.75 0 top
MCU1  25.78,8.89 45 top
PMIC1:C2  220pF  [WCAP-CSGP_0603_WAVE]  28.07,34.54 180 top
PMIC1:C3  45uF  [2.6X1.6X1(BXCXA)]  18.29,30.23 270 top
PMIC1:C4  4.7uF  [WCAP-CSGP_0603_WAVE]  21.59,29.72 270 top
PMIC1:C6  4.7uF  [WCAP-CSGP_0603_WAVE]  31.5,29.72 270 top
PMIC1:C7  4.7uF  [WCAP-CSGP_0603_WAVE]  31.5,26.67 90 top
PMIC1:C10  10uF  [2.6X1.6X1(BXCXA)]  35.05,30.23 270 top
PMIC1:D1  MBR0540T1  [SOD123]  23.88,30.23 270 top
PMIC1:D3  1N4148WS  [SOD323]  28.7,37.08 90 top
PMIC1:L1  1uH  [WE-LQ_M]  22.48,35.56 180 top
PMIC1:R11  10K  [R0603]  30.23,23.88 90 top
PMIC1:R12  17K5  [R0603]  27.94,23.88 90 top
PMIC1:R13  27K  [R0603]  38.73,29.59 90 top
PMIC1:U$4  LT1936  [MSOP8]  27.94,28.45 180 top
PMIC2:C8  [WCAP-CSGP_0603_WAVE]  27.56,74.04 90 bottom
PMIC2:DZ1  MBR0540T1  [SOD123]  27.3,68.96 180 bottom
PMIC2:L2  68uH  [WE-LQ_M]  30.61,65.41 90 bottom
PMIC2:PMIC1  ILD4001  [SC74_INFINEON]  30.23,73.15 180 bottom
PMIC2:R14  [R0603]  33.4,69.98 270 bottom
PMIC2:U1  PMXB56EN  [DFN1010D-3]  31.37,69.6 0 bottom
PMIC3:C8  [WCAP-CSGP_0603_WAVE]  15.62,74.8 90 bottom
PMIC3:DZ1  MBR0540T1  [SOD123]  15.75,68.96 180 bottom
PMIC3:L2  68uH  [WE-LQ_M]  19.3,65.41 90 bottom
PMIC3:PMIC1  ILD4001  [SC74_INFINEON]  18.29,73.53 180 bottom
PMIC3:R14  [R0603]  21.97,70.87 270 bottom
PMIC3:U1  PMXB56EN  [DFN1010D-3]  19.68,69.85 0 bottom
PMIC4:C8  [WCAP-CSGP_0603_WAVE]  26.8,59.82 90 bottom
PMIC4:DZ1  MBR0540T1  [SOD123]  26.8,54.61 180 bottom
PMIC4:L2  68uH  [WE-LQ_M]  31.24,51.18 90 bottom
PMIC4:PMIC1  ILD4001  [SC74_INFINEON]  29.46,58.42 180 bottom
PMIC4:R14  [R0603]  33.53,56.13 270 bottom
PMIC4:U1  PMXB56EN  [DFN1010D-3]  30.73,54.99 0 bottom
PMIC5:C8  [WCAP-CSGP_0603_WAVE]  15.62,59.44 90 bottom
PMIC5:DZ1  MBR0540T1  [SOD123]  15.62,54.48 180 bottom
PMIC5:L2  68uH  [WE-LQ_M]  19.56,51.56 90 bottom
PMIC5:PMIC1  ILD4001  [SC74_INFINEON]  18.16,58.67 180 bottom
PMIC5:R14  [R0603]  21.59,56.26 270 bottom
PMIC5:U1  PMXB56EN  [DFN1010D-3]  19.43,55.5 0 bottom
R1  62.87,77.47 180 top
R2  33.27,3.81 0 top
R3  13.72,6.35 90 top
R4  68.2,66.93 0 top
R5  62.87,56.13 180 top
R6  52.07,56.13 180 top
R7  21.59,2.29 270 top
R8  19.43,2.41 90 top
R9  17.78,5.59 90 top
R10  33.27,1.78 0 top
R11  13.34,16.13 90 bottom
R12  13.34,19.94 270 bottom
R13  2.41,18.16 180 bottom
R14  16.89,13.21 180 bottom
R15  17.14,22.99 0 bottom
R16  2.41,22.86 0 bottom
R35  11.05,6.22 90 top
R36  17.4,2.16 90 top
SW1  8.51,18.03 90 top
U$1  6.22,47.12 0 top
U$2  37.72,47.37 0 top
U$3  6.22,79.76 0 top
U$4  38.23,77.47 0 top
U$8  38.23,37.47 0 top
U$10  5.97,5.71 0 top
U$11  38.23,5.97 0 top
U$15  6.22,37.21 0 top

### Tracks (layer width: path | path; a pad name or v marks a point on that pad's centre or on a via)
DRIVER_LEDB  (1 unrouted)
  Top 0.406: LEDB4.4 LEDB4.3 LEDB2.4 LEDB2.3
DRIVER_LEDG  (1 unrouted)
  Top 0.406: LEDG2.4 LEDG2.3
DRIVER_LEDR  (2 unrouted)
  Top 0.406: LEDR4.4 LEDR4.3 LEDR2.4 LEDR2.3 54.31,57.79 43.05,57.79 43.05,57.85 LEDR6.4
DRIVER_LEDW  (1 unrouted)
  Top 0.406: LEDW2.4 LEDW2.3
ENCODER_A  (via drill 0.6)  (1 unrouted)
  Top 0.254: v19.81,18.8 20.45,18.16
  Bottom 0.254: R14.2 18.67,13.21 19.81,14.35 v19.81,18.8
  Bottom 0.406: C2.2 17.74,15.28 R14.2
ENCODER_B  (via drill 0.6)  (1 unrouted)
  Top 0.254: v19.56,20.19 19.68,20.19 20.45,19.43
  Bottom 0.254: 18,20.79 18.96,20.79 v19.56,20.19
  Bottom 0.406: C3.2 18,20.79 R15.1
ENCODER_D  (via drill 0.6)  (1 unrouted)
  Top 0.254: v14.1,21.84 19.05,21.84 19.68,21.21
  Bottom 0.254: C4.2 3.34,23.41 4.06,24.13 4.06,26.54 4.32,26.8 11.18,26.8 11.56,26.42 11.56,22.35 12.06,21.84 v14.1,21.84
  Bottom 0.406: R16.1 3.34,22.86 C4.2
GND_MCU  (27 unrouted)
  Top 0.254: MCU1.47 27.57,15.25 28.32,16 39.88,16 40.39,16.51 40.39,29.46 40.13,29.72 39.75,29.72 39.62,29.59 36.83,29.59 36.83,28.96 36.32,28.45 35.07,28.45 PMIC1:C10.1
  pour Top: 17.65,29.72 26.04,29.72 26.04,31.5 27.05,31.5 27.05,29.84 41.02,29.84 41.02,26.92 17.65,26.92
  pour Top: 29.21,23.49 32.38,23.49 32.38,27.18 41.02,27.18 41.02,22.1 29.21,22.1
  pour Bottom: 26.54,73.79 29.84,73.91 29.84,74.68 33.91,74.68 33.91,70.23 31.62,70.23 31.62,71.88 26.54,71.88
  pour Bottom: 15.24,74.17 17.78,74.17 17.78,75.31 22.61,75.31 22.61,70.48 19.68,70.48 19.68,72.26 15.24,72.26
  pour Bottom: 26.16,59.18 29.08,59.18 29.08,60.33 34.04,60.33 34.04,56.77 26.16,56.77
  pour Bottom: 14.86,56.77 22.48,56.77 22.48,60.07 17.78,60.07 17.78,59.18 14.86,59.18
  pour Bottom: 19.05,19.68 19.05,16.51 17.14,16.51 17.14,17.02 10.67,17.02 10.67,9.78 4.57,9.78 4.57,26.29 10.79,26.29 10.79,19.18 17.02,19.18 17.02,19.68
LEDB  (1 unrouted)
LEDG  (1 unrouted)
LEDR  (1 unrouted)
LEDW  (1 unrouted)
N$1
  Bottom 0.406: R14.1 16.04,15.53 SW1.A 13.59,15.53 R11.1
N$2
  Bottom 0.406: R15.2 16.01,22.99 SW1.B 13.46,20.53 R12.1
N$3
  Top 0.406: LEDG1.3 LEDG1.4 LEDG2.2 LEDG2.1
N$4
  Top 0.406: LEDB2.1 LEDB2.2 LEDB1.4 LEDB1.3
N$5  (1 unrouted)
N$6
  Top 0.406: LEDB3.3 LEDB3.4 LEDB4.2 LEDB4.1
N$7
  Top 0.406: LEDR1.3 LEDR1.4 LEDR2.2 LEDR2.1
N$8  (1 unrouted)
N$9
  Bottom 0.254: C29.1 37.85,11.05 38.23,10.67 U$11.PIN1
N$10  (1 unrouted)
N$11  (1 unrouted)
N$12
  Top 0.406: LEDR4.1 LEDR4.2 LEDR3.4 LEDR3.3
N$13
  pour Bottom: 36.2,33.4 41.02,33.4 41.02,9.53 34.67,9.53 34.67,2.79 9.65,2.79 9.65,6.48 33.4,6.48 33.4,10.67 36.2,10.67
N$14
  Top 0.406: LEDR6.1 LEDR6.2 LEDR5.4 LEDR5.3
N$15  (1 unrouted)
N$16
  Bottom 0.406: R16.2 1.51,22.86 SW1.E 1.51,18.29 R13.1
N$17  (1 unrouted)
N$18  (1 unrouted)
N$19  (2 unrouted)
N$20  (1 unrouted)
N$25
  Top 0.406: LEDW2.1 LEDW2.2 LEDW1.4 LEDW1.3
N$26  (1 unrouted)
N$27  (1 unrouted)
PMIC1:N$28  (1 unrouted)
PMIC1:N$30
  Top 0.254: PMIC1:U$4.5 26.96,23.88 31.5,23.88 PMIC1:C7.1 31.5,25.78 38.73,25.78 PMIC1:R13.1
PMIC1:N$35
  Top 0.254: PMIC1:R11.2 PMIC1:R12.2 27.61,24.73 PMIC1:U$4.6
PMIC1:PMIC_LT1936_BOOST  (via drill 0.5)
  Top 0.254: PMIC1:U$4.1 29.84,30.62 v30.1,31.11 | v30.1,34.29 29.84,34.54 PMIC1:C2.1
  Bottom 0.254: v30.1,31.11 v30.1,34.29
  pour Top: 28.07,36.96 30.73,36.96 30.73,33.66 28.07,33.66
  pour Top: 28.96,30.23 28.96,31.62 30.48,31.62 30.48,30.23
PMIC1:PMIC_LT1936_SW
  pour Top: 27.69,30.48 27.69,36.96 22.61,36.96 22.61,30.1 25.65,30.1 25.65,32 27.43,32 27.43,30.48
PMIC2:N$2
  Bottom 0.254: PMIC2:PMIC1.4 31.18,70.3 PMIC2:U1.1 30.99,69.6 33.4,69.6 PMIC2:R14.2
PMIC2:N$29
  pour Bottom: 28.19,70.1 28.19,66.17 32.38,66.17 32.38,69.21 30.61,69.21 30.61,70.1
PMIC3:N$2
  Bottom 0.254: PMIC3:PMIC1.4 19.24,70.55 PMIC3:U1.1 19.31,70.02 PMIC3:R14.2
PMIC3:N$29
  pour Bottom: 16.51,70.74 16.51,65.66 20.95,65.66 20.95,69.6 18.8,69.6 18.8,70.74
PMIC4:N$2
  Bottom 0.254: PMIC4:R14.2 33.02,55.28 33.02,55.12 30.41,55.12 30.41,55.69 | PMIC4:PMIC1.4 30.41,55.69 | 30.41,55.69 PMIC4:U1.1
PMIC4:N$29
  pour Bottom: 27.3,55.63 27.3,52.07 33.02,51.94 33.02,54.23 29.84,54.23 29.84,55.63
PMIC5:N$2
  Bottom 0.254: PMIC5:PMIC1.4 19.11,56.2 PMIC5:U1.1 19.06,55.75 21.21,55.75 21.21,55.41 PMIC5:R14.2
PMIC5:N$29
  pour Bottom: 16.38,54.99 16.38,52.32 21.21,52.32 21.21,54.36 19.81,54.36 19.81,54.99
S3V3_MCU_VDD  (via drill 0.6)  (4 unrouted)
  Top 0.406: v11.56,16.76 11.43,16.76 11.43,18.03 | 11.43,18.03 v4.83,18.03 | v11.56,19.3 11.43,19.3 11.43,18.03
  Bottom 0.406: R11.2 11.56,16.98 v11.56,16.76 | v4.83,18.03 3.26,18.03 R13.2 | R12.2 11.56,19.09 v11.56,19.3
  pour Top: 30.86,37.34 22.23,37.34 22.23,30.23 18.54,30.23 18.54,39.12 30.86,39.12
  pour Top: 16.38,33.91 19.05,33.91 19.05,30.23 17.27,30.23 17.27,26.54 26.42,26.54 26.42,23.49 28.7,23.49 28.7,22.1 24.89,22.1 24.89,25.27 16.38,25.27
  pour Top: 14.61,16.64 2.67,16.64 2.67,19.68 14.61,19.68
  pour Top: 30.48,39.12 10.03,39.12 10.03,33.53 3.3,33.53 3.17,9.4 9.65,9.4 9.65,4.19 11.81,4.19 11.81,10.41 4.32,10.41 4.32,32.64 11.18,32.64 11.18,37.97 30.48,37.97
  pour Top: 11.81,10.41 20.7,10.41 20.7,8.38 11.81,8.38
SUPPLY_24V  (9 unrouted)
  pour Bottom: 17.53,74.55 14.73,74.55 14.73,67.44 12.7,67.44 12.7,76.45 17.53,76.45
  pour Top: 39.37,30.23 30.73,30.23 30.73,32 28.45,32 28.45,30.48 28.07,30.48 28.07,33.27 39.37,33.27
  pour Bottom: 29.46,74.3 29.46,75.56 24.26,75.56 24.26,66.8 26.16,66.8 26.16,74.3
  pour Bottom: 25.78,59.56 28.7,59.56 28.7,61.21 23.75,61.21 23.75,53.34 25.78,53.34
  pour Bottom: 14.48,59.56 14.48,53.72 12.57,53.72 12.57,61.21 17.53,61.21 17.53,59.56
SWCLK  (1 unrouted)
SWDIO  (1 unrouted)
SWO  (1 unrouted)
TDI  (1 unrouted)
VSENSE_LEDB  (2 unrouted)
  Top 0.406: LEDB3.2 LEDB3.1 LEDB1.2 LEDB1.1
VSENSE_LEDG  (2 unrouted)
  Top 0.406: LEDG1.1 LEDG1.2
VSENSE_LEDR  (2 unrouted)
  Top 0.406: LEDR3.2 LEDR3.1 LEDR1.2 LEDR1.1 LEDR5.2 LEDR5.1
VSENSE_LEDW  (2 unrouted)
  Top 0.406: LEDW1.2 LEDW1.1
VTREF  (1 unrouted)